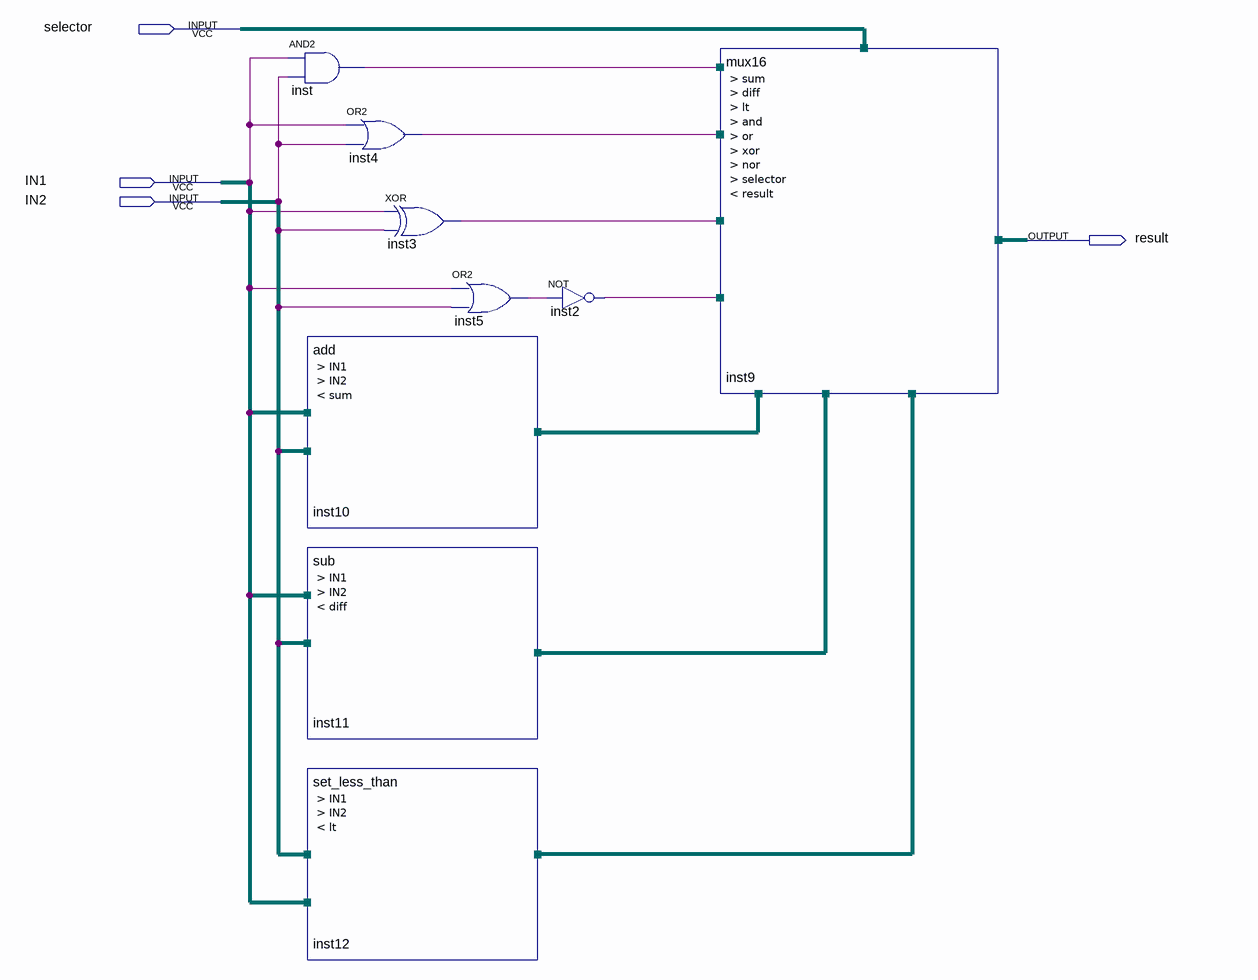
[diagram p0: schematic sheet]
// Quartus schematic riscv-alu.bdf as structural Verilog: 9 symbols, 4 pins
module \riscv-alu  (
  input  selector,
  input  IN1,
  input  IN2,
  output result
);

  wire diff, inst2_out, inst3_out, inst4_out, inst5_out, inst_out, lt, sum, undriven, undriven_2, undriven_3,
       undriven_4, undriven_5, undriven_6;

  and inst (inst_out, undriven_5, undriven_6);
  or inst4 (inst4_out, undriven_5, undriven_6);
  add inst10 (.IN1(IN1), .IN2(IN2), .sum(sum));
  sub inst11 (.IN1(IN1), .IN2(IN2), .diff(diff));
  set_less_than inst12 (.IN1(IN1), .IN2(IN2), .lt(lt));
  xor inst3 (inst3_out, undriven, undriven_2);
  or inst5 (inst5_out, undriven_3, undriven_4);
  not inst2 (inst2_out, inst5_out);
  mux16 inst9 (.sum(sum), .diff(diff), .lt(lt), .selector(selector), .result(result));  // open: and, or, xor, nor
endmodule
